# EAGLE design amp (EAGLE 9.0.1)
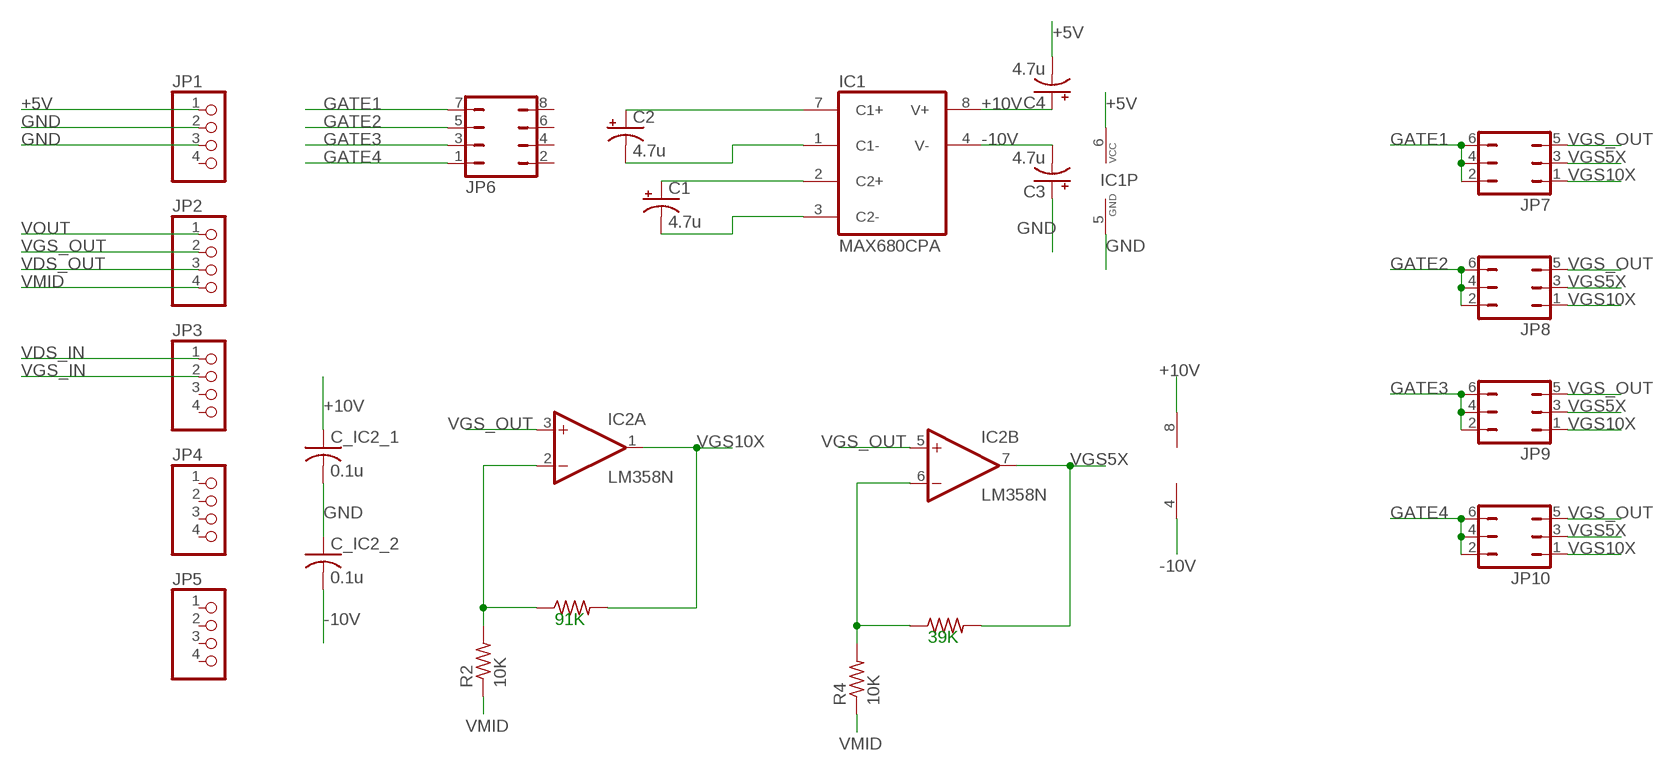
[diagram p0: schematic, sheet 1]

## Parts
C1  4.7u  CPOL-USB45181B  [B45181B]
C2  4.7u  CPOL-USB45181B  [B45181B]
C3  4.7u  CPOL-USB45181B  [B45181B]
C4  4.7u  CPOL-USB45181B  [B45181B]
C_IC2_1  0.1u  C-US025-024X044  [C025-024X044]
C_IC2_2  0.1u  C-US025-024X044  [C025-024X044]
IC1  MAX680CPA  [DIL08]
IC2  LM358N  [DIL08]
JP1  PINHD-1X4  [1X04]
JP2  PINHD-1X4  [1X04]
JP3  PINHD-1X4  [1X04]
JP4  PINHD-1X4  [1X04]
JP5  PINHD-1X4  [1X04]
JP6  JP4Q  [JP4Q]
JP7  JP3Q  [JP3Q]
JP8  JP3Q  [JP3Q]
JP9  JP3Q  [JP3Q]
JP10  JP3Q  [JP3Q]
R1  91K  R-US_0204/7  [0204/7]
R2  10K  R-US_0204/7  [0204/7]
R3  39K  R-US_0204/7  [0204/7]
R4  10K  R-US_0204/7  [0204/7]

## Nets
+5V: C4.- IC1.6(VCC) JP1.1
+10V: C4.+ C_IC2_1.1 IC1.8(V+) IC2.8(P:V+)
-10V: C3.- C_IC2_2.2 IC1.4(V-) IC2.4(P:V-)
GATE1: JP6.7 JP7.2 JP7.4 JP7.6
GATE2: JP6.5 JP8.2 JP8.4 JP8.6
GATE3: JP6.3 JP9.2 JP9.4 JP9.6
GATE4: JP6.1 JP10.2 JP10.4 JP10.6
GND: C3.+ C_IC2_1.2 C_IC2_2.1 IC1.5(GND) JP1.2 JP1.3
N$1: C2.+ IC1.7(C1+)
N$2: C2.- IC1.1(C1-)
N$3: C1.+ IC1.2(C2+)
N$4: C1.- IC1.3(C2-)
N$5: IC2.2(A:-IN) R1.1 R2.2
N$6: IC2.6(B:-IN) R3.1 R4.2
VDS_IN: JP3.1
VDS_OUT: JP2.3
VGS5X: IC2.7(B:OUT) JP7.3 JP8.3 JP9.3 JP10.3 R3.2
VGS10X: IC2.1(A:OUT) JP7.1 JP8.1 JP9.1 JP10.1 R1.2
VGS_IN: JP3.2
VGS_OUT: IC2.3(A:+IN) IC2.5(B:+IN) JP2.2 JP7.5 JP8.5 JP9.5 JP10.5
VMID: JP2.4 R2.1 R4.1
VOUT: JP2.1
Unconnected: JP1.4 JP3.3 JP3.4 JP4.1 JP4.2 JP4.3 JP4.4 JP5.1 JP5.2 JP5.3 JP5.4 JP6.2 JP6.4 JP6.6 JP6.8

## Notes on the sheet
- 91K
- 39K

## Library data of the parts
C1-C4 = rcl:CPOL-US: POLARIZED CAPACITOR, American symbol; SPICEPREFIX: C
C_IC2_1 C_IC2_2 = rcl:C-US: CAPACITOR, American symbol; SPICEPREFIX: C
IC1 = maxim:MAX680CPA: Switched-capcitor VOLTAGE CONVERTER; MPN: MAX680CPA; OC_FARNELL: 1187929; OC_NEWARK: 34C3974
IC2 = linear:LM358: OP AMP also LM158; LM258; LM2904 Source: http://cache.national.com/ds/LM/LM158.pdf
JP1-JP5 = pinhead:PINHD-1X4: PIN HEADER
JP6 = jumper:JP4Q: JUMPER
JP7-JP10 = jumper:JP3Q: JUMPER
R1-R4 = rcl:R-US_: RESISTOR, American symbol; SPICEPREFIX: R

## Net classes
0 default: width 0.254 mm

## Board
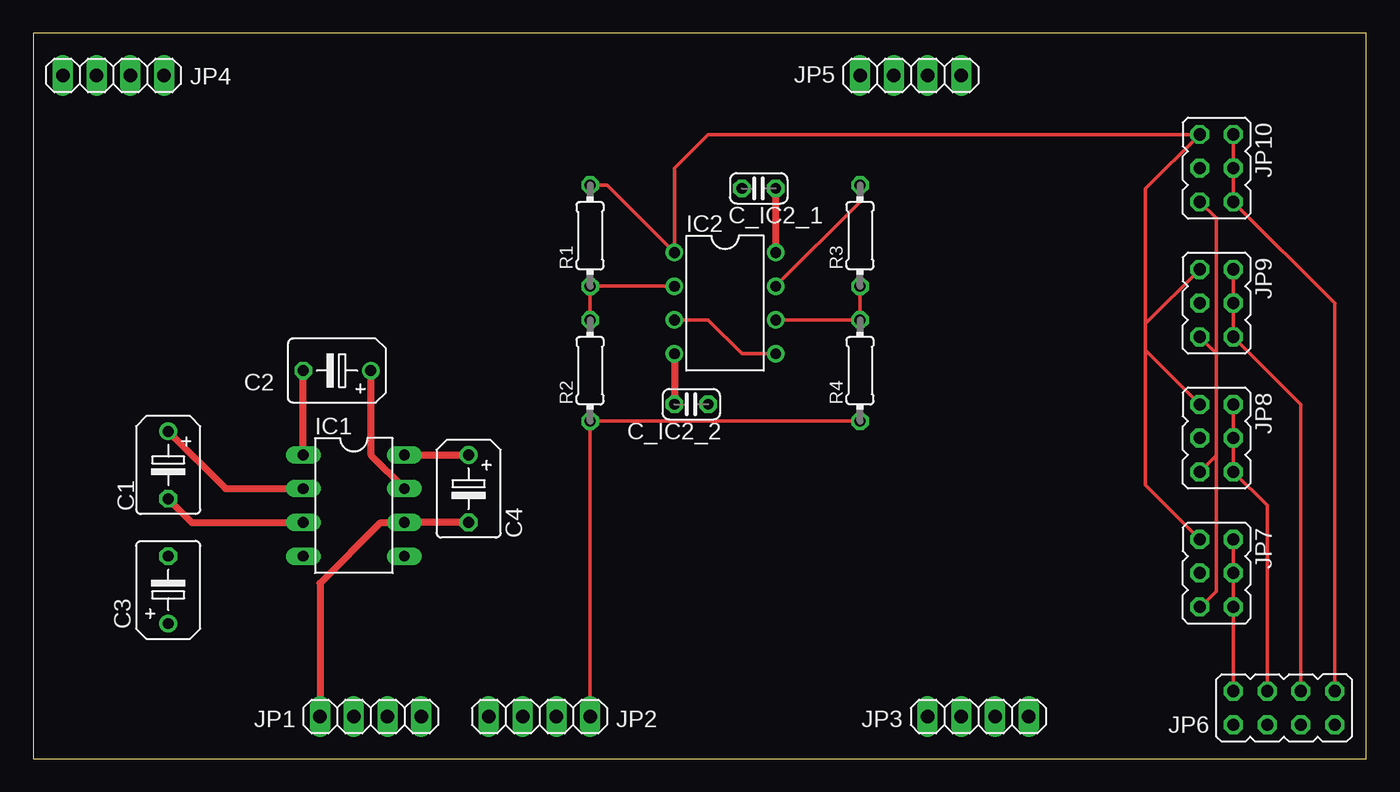
[diagram p1: board, top side]
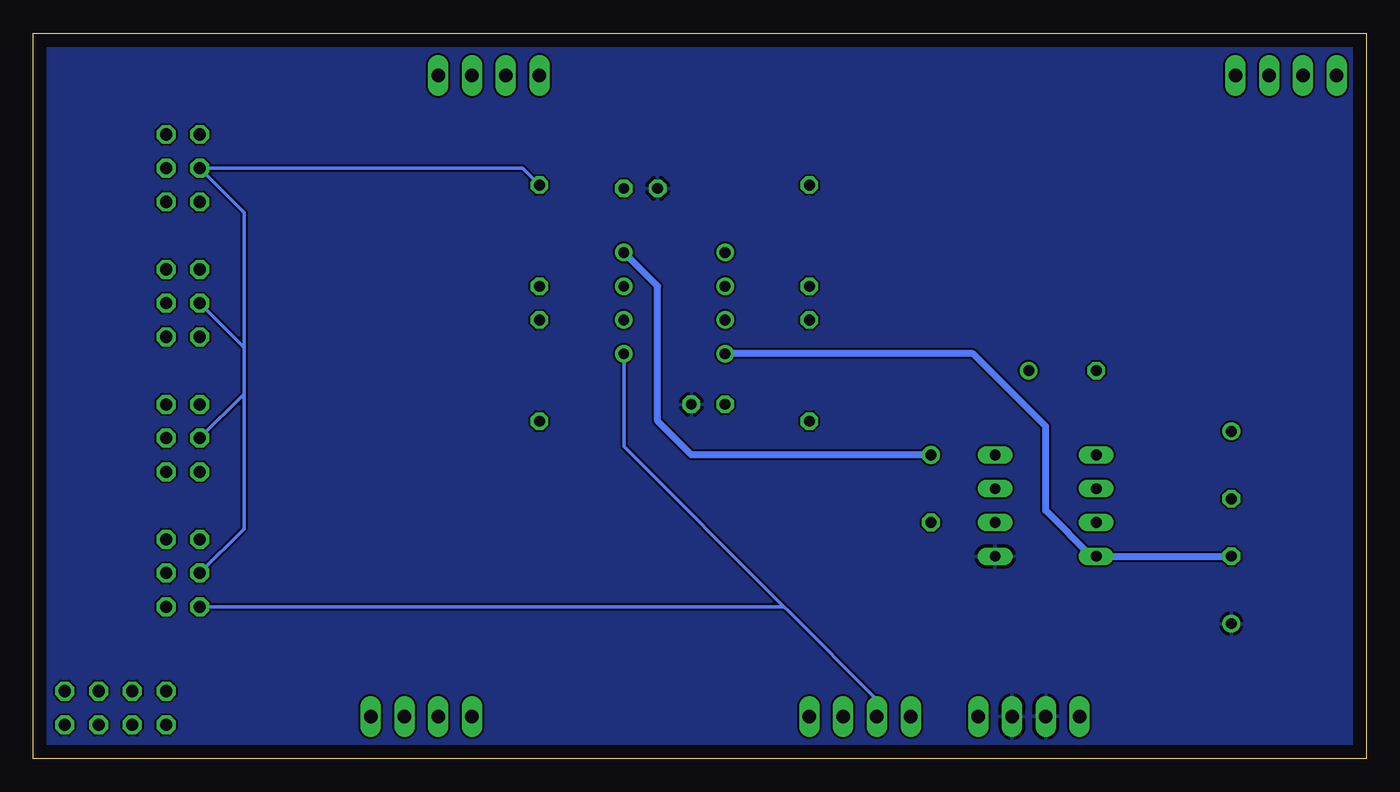
[diagram p2: board, bottom side, seen from below]

Size 100.33 x 54.61 mm. Coordinates in mm from the lower left corner, seen from the top.
Outline: 0,0 100.33,0 100.33,54.61 0,54.61 0,0
Copper layers (1*16): Top 0.035mm / dielectric 1.5mm / Bottom 0.035mm
Design rules "default": minimum track width 6mil, minimum drill 0.35mm, track to track 6mil, track to pad 6mil, pad to pad 6mil, via to via 6mil, smd to smd 6mil, copper to edge 40mil, drill to drill 6mil, minimum pad ring 10mil, minimum via ring 8mil, stop-mask expansion 4mil, vias tented up to drill 0mil, thermal gap 10mil

### Footprints (pad centres in the part's own frame; a part is rotated, then mirrored left to right if it is on the bottom)
B45181B = drill 0.813: + -2.54,0 | drill 0.813 octagon: - 2.54,0
C025-024X044 = drill 0.813 octagon: 1 -1.27,0; 2 1.27,0
DIL08 = drill 0.813 long: 1 -3.81,-3.81; 2 -1.27,-3.81; 3 1.27,-3.81; 4 3.81,-3.81; 5 3.81,3.81; 6 1.27,3.81; 7 -1.27,3.81; 8 -3.81,3.81
DIL08' = drill 0.813 pad 1.27: 1 -3.81,-3.81; 2 -1.27,-3.81; 3 1.27,-3.81; 4 3.81,-3.81; 5 3.81,3.81; 6 1.27,3.81; 7 -1.27,3.81; 8 -3.81,3.81
1X04 = drill 1.016 long: 1 -3.81,0; 2 -1.27,0; 3 1.27,0; 4 3.81,0
JP4Q = drill 0.914 octagon: 1 -3.81,-1.27; 2 -3.81,1.27; 3 -1.27,-1.27; 4 -1.27,1.27; 5 1.27,-1.27; 6 1.27,1.27; 7 3.81,-1.27; 8 3.81,1.27
JP3Q = drill 0.914 octagon: 1 -2.54,-1.27; 2 -2.54,1.27; 3 0,-1.27; 4 0,1.27; 5 2.54,-1.27; 6 2.54,1.27
0204/7 = drill 0.813 octagon: 1 -3.81,0; 2 3.81,0

### Placement (x,y rotation side)
C1  10.16,22.1 270 top
C2  22.86,29.21 180 top
C3  10.16,12.7 90 top
C4  32.77,20.32 270 top
C_IC2_1  54.61,42.93 180 top
C_IC2_2  49.53,26.67 180 top
IC1  24.13,19.05 270 top
IC2  LM358N  [DIL08']  52.07,34.29 270 top
JP1  25.4,3.17 0 top
JP2  38.1,3.17 0 top
JP3  71.12,3.17 0 top
JP4  6.03,51.44 0 top
JP5  66.04,51.44 0 top
JP6  94.14,3.81 180 top
JP7  89.06,13.97 270 top
JP8  89.06,24.13 270 top
JP9  89.06,34.29 270 top
JP10  89.06,44.45 270 top
R1  41.91,39.37 90 top
R2  41.91,29.21 90 top
R3  62.23,39.37 90 top
R4  62.23,29.21 90 top

### Tracks (layer width: path | path; a pad name or v marks a point on that pad's centre or on a via)
+5V
  Top 0.508: JP1.1 21.59,13.21 26.16,17.78 IC1.6 C4.-
+10V
  Top 0.508: IC1.8 C4.+ | C_IC2_1.1 IC2.8
  Bottom 0.508: C4.+ 50.8,22.86 53.34,25.4 53.34,35.56 IC2.8
-10V
  Top 0.508: IC2.4 C_IC2_2.2
  Bottom 0.254: 20.7,15.24 IC1.4
  Bottom 0.508: 20.7,15.24 24.13,18.67 24.13,25.02 29.59,30.48 IC2.4 | IC1.4 C3.-
GATE1
  Top 0.254: JP7.2 JP7.4 JP7.6 JP6.7
GATE2
  Top 0.254: JP6.5 92.87,18.29 92.87,19.05 JP8.6 JP8.4 JP8.2
GATE3
  Top 0.254: JP6.3 95.41,25.4 95.41,26.67 JP9.6 JP9.4 JP9.2
GATE4
  Top 0.254: JP6.1 97.95,33.91 97.95,34.29 JP10.6 JP10.4 JP10.2
GND
  pour Bottom: 0.25,54.36 0.25,0.25 100.08,0.25 100.08,54.36
N$1
  Top 0.508: C2.+ 25.4,22.86 IC1.7
N$2
  Top 0.508: IC1.1 C2.-
N$3
  Top 0.508: C1.+ 14.48,20.32 IC1.2
N$4
  Top 0.508: C1.- 11.94,17.78 IC1.3
N$5
  Top 0.254: R2.2 R1.1 IC2.2
N$6
  Top 0.254: IC2.6 R4.2 R3.1
VGS5X
  Top 0.254: IC2.7 62.23,41.91 R3.2
  Bottom 0.254: JP7.3 84.45,17.3 84.45,27.46 | 84.45,30.96 84.45,41.12 87.71,44.37 JP10.3 63.5,44.45 R3.2 | 84.45,30.96 84.45,27.46 | JP8.3 84.45,27.46 | JP9.3 84.45,30.96
VGS10X
  Top 0.254: JP7.1 83.69,20.61 83.69,30.77 | 83.69,32.73 83.69,42.89 JP10.1 50.8,46.99 48.26,44.45 IC2.1 43.18,43.18 R1.2 | JP8.1 83.69,30.77 | JP9.1 83.69,32.73 | 83.69,32.73 83.69,30.77
VGS_OUT
  Top 0.254: JP10.5 89.03,40.67 89.03,30.51 | 89.03,30.51 89.03,22.83 | 89.03,22.83 89.03,12.57 87.88,11.43 JP7.5 | JP8.5 89.03,22.83 | JP9.5 89.03,30.51 | IC2.3 50.8,33.02 53.34,30.48 IC2.5
  Bottom 0.254: 43.81,11.43 43.5,11.11 36.83,4.45 JP2.2 | JP7.5 43.81,11.43 | 43.81,11.43 55.88,23.5 IC2.5
VMID
  Top 0.254: R4.1 R2.1 JP2.4

### Text on the board
tValues: G4 | Palacios Group, MIT / Designed by Jaeyoung Jung (jungj@mit.edu) | 10X | 5X | 1X | G3 | 10X | 5X | 1X | G2 | 10X | 5X | 1X | WARNING: Never connect more / than one jumper per gate. | G1 | 10X | 5X | 1X | G1 | G2 | G3 | G4 | 5V | GND | GND | OUT | VGS | VDS | MID | DAC1 | DAC2